# EAGLE design clock (EAGLE 9.6.2)
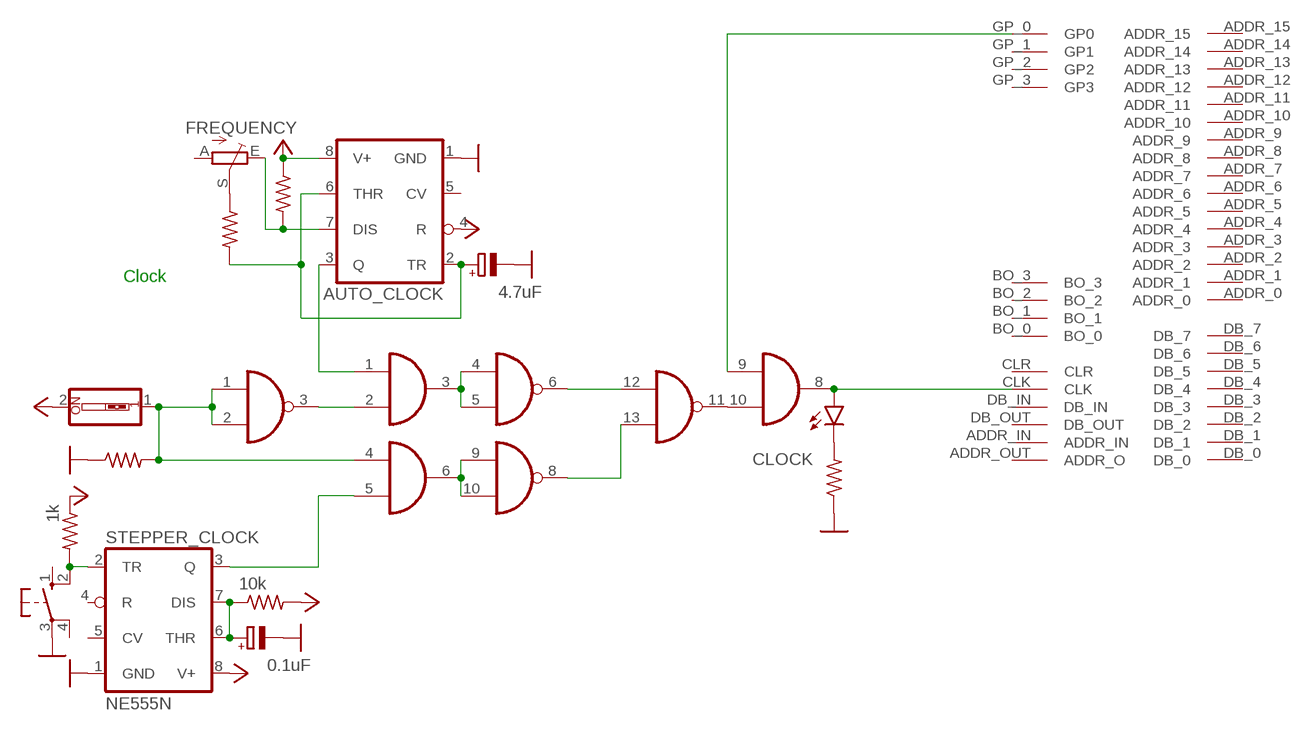
[diagram p0: schematic, sheet 1]

## Parts
AND_GATE_  74LS08N  [DIL14]
AUTO_CLOCK  NE555N  [DIL08]
C1  4.7uF  CPOL-EUE2-5  [E2-5]
C2  0.1uF  CPOL-EUE2-5  [E2-5]
CLK_MODE  SWITCH  SW_DIP-1  [EDG-01]
CLK_TRIGGER  SWITCH  10-XX  [B3F-10XX]
CLOCK  Yellow  LED5MM  [LED5MM]
FREQUENCY  100k  TRIM_EU-RJ9W  [RJ9W]
NAND  74ACT00N  [DIL14]
R1  1k  R-US_0204/7  [0204/7]
R2  1k  R-US_0204/7  [0204/7]
R3  10k  R-US_0204/7  [0204/7]
R4  220  R-US_0204/7  [0204/7]
R5  ~220  R-US_0204/7  [0204/7]
R6  220  R-US_0204/7  [0204/7]
STEPPER_CLOCK  NE555N  [DIL08]
U$1  BACKPLATE_INTERFACEEDGE_FINGER  [BACK_INTERFACE-FOOT]

## Nets
CLOCK: AND_GATE_.8(C:O) CLOCK.A U$1.CLK
GND: AUTO_CLOCK.1(GND) C1.- C2.- CLK_TRIGGER.3(P) R4.1 R5.1 STEPPER_CLOCK.1(GND)
HLT: AND_GATE_.9(C:I0) U$1.GP_0(GP0)
MODE_SIGNAL: AND_GATE_.4(B:I0) CLK_MODE.1 NAND.1(A:I0) NAND.2(A:I1) R4.2
N$1: C2.+ R3.1 STEPPER_CLOCK.6(THR) STEPPER_CLOCK.7(DIS)
N$2: CLK_TRIGGER.2(S1) R2.2 STEPPER_CLOCK.2(TR)
N$3: CLOCK.K(C) R5.2
N$4: AND_GATE_.5(B:I1) STEPPER_CLOCK.3(Q)
N$5: AND_GATE_.3(A:O) NAND.4(B:I0) NAND.5(B:I1)
N$6: AND_GATE_.1(A:I0) AUTO_CLOCK.3(Q)
N$7: AND_GATE_.6(B:O) NAND.9(C:I0) NAND.10(C:I1)
N$8: NAND.8(C:O) NAND.13(D:I1)
N$9: AND_GATE_.2(A:I1) NAND.3(A:O)
N$10: NAND.6(B:O) NAND.12(D:I0)
N$11: AND_GATE_.10(C:I1) NAND.11(D:O)
N$16: AUTO_CLOCK.2(TR) AUTO_CLOCK.6(THR) C1.+ R6.2
N$51: FREQUENCY.S R6.1
N$78: AUTO_CLOCK.7(DIS) FREQUENCY.E R1.2
VCC: AUTO_CLOCK.4(R) AUTO_CLOCK.8(V+) CLK_MODE.2 R1.1 R2.1 R3.2 STEPPER_CLOCK.8(V+)
Unconnected: AND_GATE_.11(D:O) AND_GATE_.12(D:I0) AND_GATE_.13(D:I1) AUTO_CLOCK.5(CV) CLK_TRIGGER.1(S) CLK_TRIGGER.4(P1) FREQUENCY.A STEPPER_CLOCK.4(R) STEPPER_CLOCK.5(CV) U$1.ADDR_0 U$1.ADDR_1 U$1.ADDR_2 U$1.ADDR_3 U$1.ADDR_4 U$1.ADDR_5 U$1.ADDR_6 U$1.ADDR_7 U$1.ADDR_8 U$1.ADDR_9 U$1.ADDR_10 U$1.ADDR_11 U$1.ADDR_12 U$1.ADDR_13 U$1.ADDR_14 U$1.ADDR_15 U$1.ADDR_IN U$1.ADDR_OUT(ADDR_O) U$1.BO_0 U$1.BO_1 U$1.BO_2 U$1.BO_3 U$1.CLR U$1.DB_0 U$1.DB_1 U$1.DB_2 U$1.DB_3 U$1.DB_4 U$1.DB_5 U$1.DB_6 U$1.DB_7 U$1.DB_IN U$1.DB_OUT U$1.GP_1(GP1) U$1.GP_2(GP2) U$1.GP_3(GP3) U$1.NC_0 U$1.NC_1 U$1.NC_2 U$1.NC_3 U$1.NC_4 U$1.NC_5 U$1.NC_6 U$1.NC_7 U$1.NC_8 U$1.NC_9 U$1.NC_10 U$1.NC_11 U$1.NC_12 U$1.NC_13 U$1.NC_14 U$1.NC_15 U$1.NC_16 U$1.NC_17 U$1.NC_18 U$1.NC_19 U$1.NC_20 U$1.NC_21

## Notes on the sheet
- Clock

## Power pins joined to a net without a drawn wire
GND: AND_GATE_.7(P:GND) NAND.7(P:GND) U$1.GND_0(GND) U$1.GND_1(GND)
VCC: AND_GATE_.14(P:VCC) NAND.14(P:VCC) U$1.VCC_0(VCC) U$1.VCC_1(VCC)

## Library data of the parts
AND_GATE_ = 74xx-eu:74*08: Quad 2-input AND gate
AUTO_CLOCK STEPPER_CLOCK = linear:*555: TIMER
C1 C2 = rcl:CPOL-EU: POLARIZED CAPACITOR, European symbol; SPICEPREFIX: C
CLK_MODE = special:SW_DIP-1: DIP SWITCH
CLK_TRIGGER = switch-omron:10-XX: OMRON SWITCH; MPN: B3F-1000; OC_FARNELL: 176432; OC_NEWARK: 36M3542
CLOCK = led:LED: LED OSRAM: - CHIPLED LG R971, LG N971, LY N971, LG Q971, LY Q971, LO R971, LY R971 LH N974, LH R974 LS Q976, LO Q976, LY Q976 LO Q996 - Hyper CHIPLED LW Q18S LB Q993, LB Q99A, LB R99A - SideLED LS A670, LO A670, LY A670, LG A670, LP A670 LB A673, LV A673, LT A673, LW A673 LH A674 LY A675 LS A676, LA A676, LO A676, LY A676, LW A676 LS A679, LY A679, LG A679 - Hyper Micro SIDELED® LS Y876, LA Y876, LO Y876, LY Y876 LT Y87S - SmartLED LW L88C, LW L88S LB L89C, LB L89S, LG L890 LS L89K, LO L89K, LY L89K LS L896, LA L896, LO L896, LY L896 - TOPLED LS T670, LO T670, LY T670, LG T670, LP T670 LSG T670, LSP T670, LSY T670, LOP T670, LYG T670 LG T671, LOG T671, LSG T671 LB T673, LV T673, LT T673, LW T673 LH T674 LS T676, LA T676, LO T676, LY T676, LB T676, LH T676, LSB T676, LW T676 LB T67C, LV T67C, LT T67C, LS T67K, LO T67K, LY T67K, LW E67C LS E67B, LA E67B, LO E67B, LY E67B, LB E67C, LV E67C, LT E67C LW T67C LS T679, LY T679, LG T679 LS T770, LO T770, LY T770, LG T770, LP T770 LB T773, LV T773, LT T773, LW T773 LH T774 LS E675, LA E675, LY E675, LS T675 LS T776, LA T776, LO T776, LY T776, LB T776 LHGB T686 LT T68C, LB T68C - Hyper Mini TOPLED® LB M676 - Mini TOPLED Santana® LG M470 LS M47K, LO M47K, LY M47K Source: http://www.osram.convergy.de LUXEON: - LUMILED® LXK2-PW12-R00, LXK2-PW12-S00, LXK2-PW14-U00, LXK2-PW14-V00 LXK2-PM12-R00, LXK2-PM12-S00, LXK2-PM14-U00 LXK2-PE12-Q00, LXK2-PE12-R00, LXK2-PE12-S00, LXK2-PE14-T00, LXK2-PE14-U00 LXK2-PB12-K00, LXK2-PB12-L00, LXK2-PB12-M00, LXK2-PB14-N00, LXK2-PB14-P00, LXK2-PB14-Q00 LXK2-PR12-L00, LXK2-PR12-M00, LXK2-PR14-Q00, LXK2-PR14-R00 LXK2-PD12-Q00, LXK2-PD12-R00, LXK2-PD12-S00 LXK2-PH12-R00, LXK2-PH12-S00 LXK2-PL12-P00, LXK2-PL12-Q00, LXK2-PL12-R00 Source: www.luxeon.com KINGBRIGHT: KA-3528ASYC Source: www.kingbright.com
FREQUENCY = pot:TRIM_EU-: POTENTIOMETER
NAND = 74xx-eu:74*00: Quad 2-input NAND gate
R1-R6 = rcl:R-US_: RESISTOR, American symbol; SPICEPREFIX: R
U$1 = Computer:BACKPLATE_INTERFACE

## Board
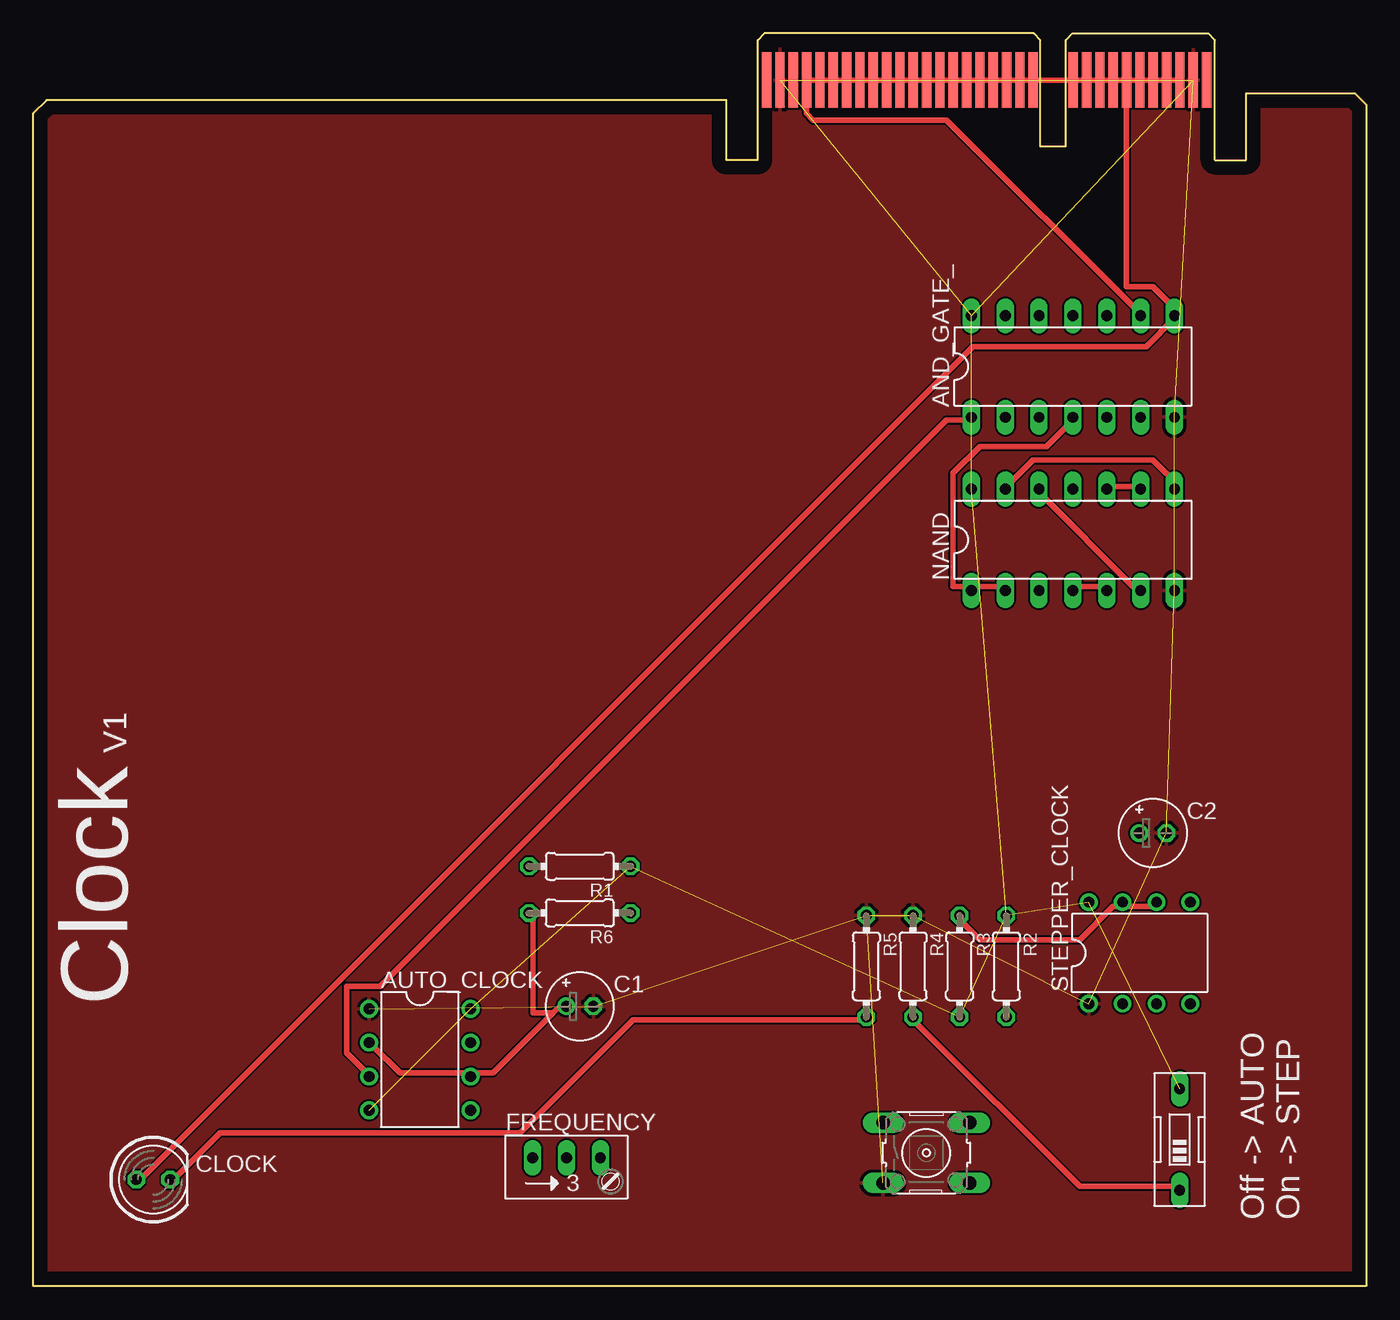
[diagram p1: board, top side]
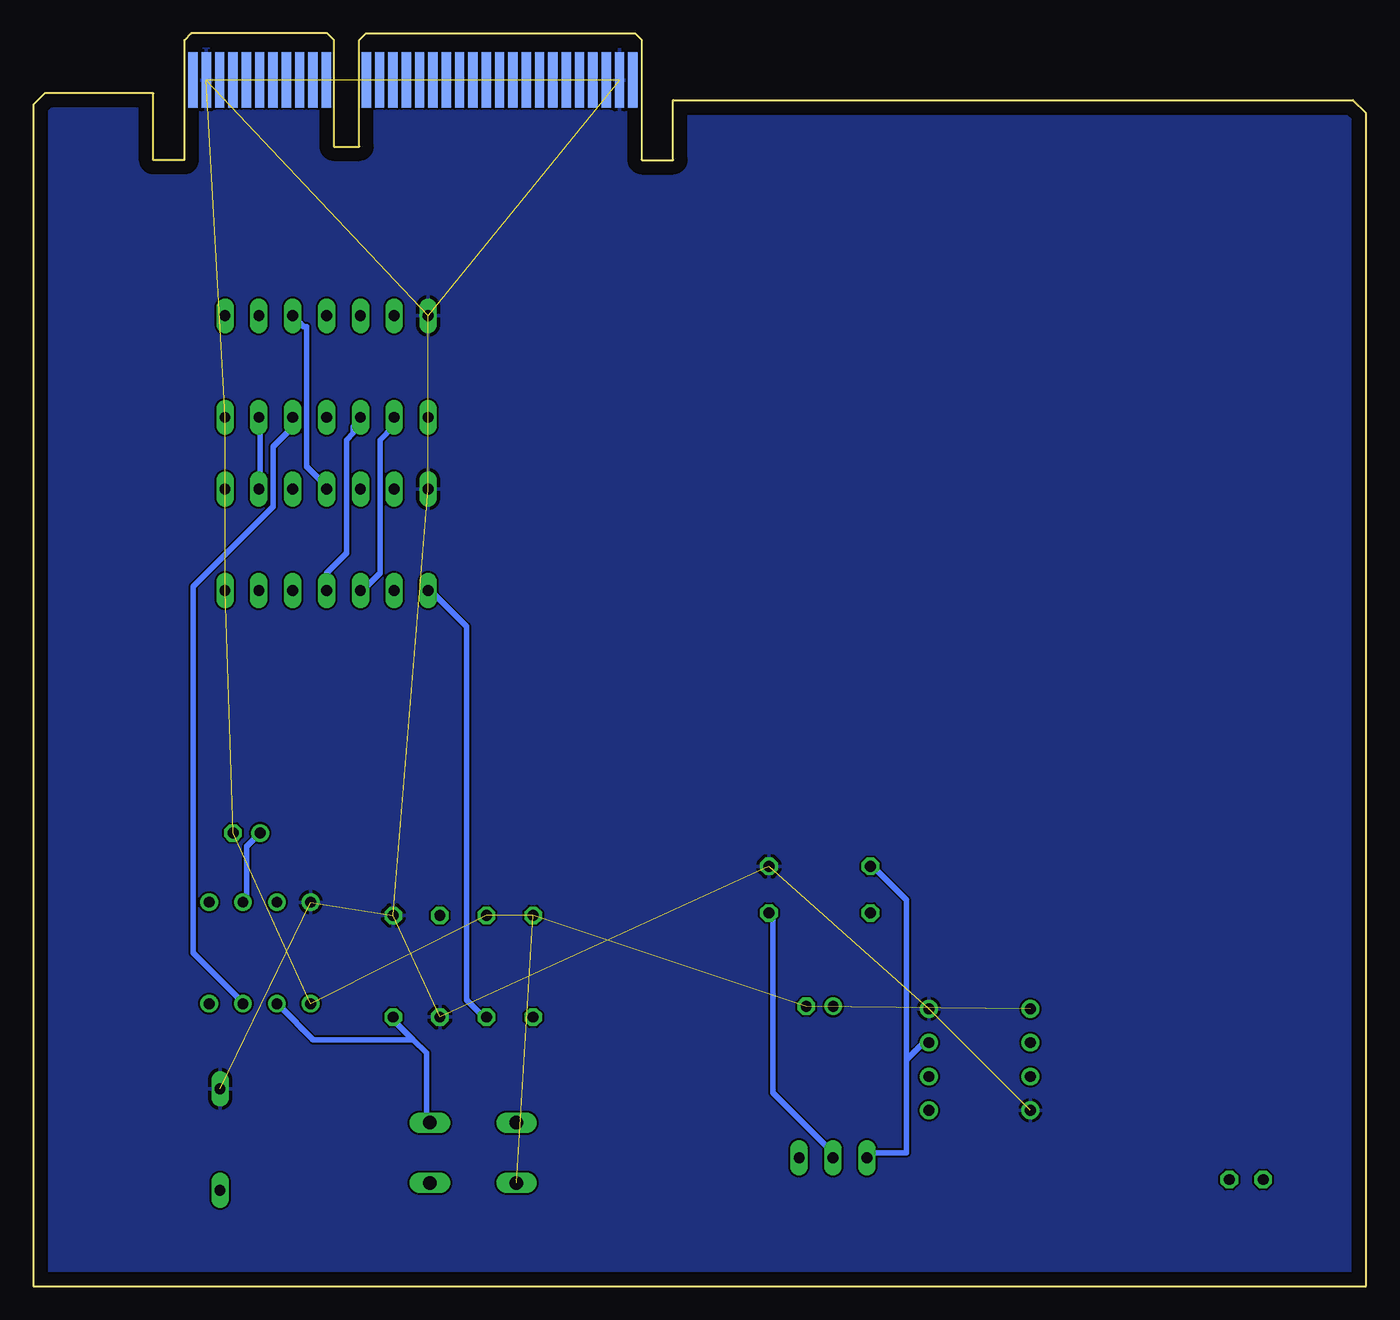
[diagram p2: board, bottom side, seen from below]

Size 100 x 94 mm. Coordinates in mm from the lower left corner, seen from the top.
Outline: 0,0 0,88 1,89 52,89 52,84.5 54.35,84.5 54.35,93.5 54.85,94 75.05,94 75.55,93.5 75.55,85.5 77.45,85.5 77.45,93.5 77.95,94 88.15,94 88.65,93.5 88.65,84.5 91,84.5 91,89.5 99.15,89.5 100,88.65 100,0 0,0
Copper layers (1*16): Top 0.035mm / dielectric 1.5mm / Bottom 0.035mm
Design rules "default *": minimum track width 16mil, minimum drill 0.35mm, track to track 6mil, track to pad 6mil, pad to pad 6mil, via to via 6mil, smd to smd 6mil, copper to edge 40mil, drill to drill 6mil, minimum pad ring 10mil, minimum via ring 8mil, stop-mask expansion 4mil, vias tented up to drill 0mil, thermal gap 10mil

### Footprints (pad centres in the part's own frame; a part is rotated, then mirrored left to right if it is on the bottom)
DIL14 = drill 0.813 long: 1 -7.62,-3.81; 2 -5.08,-3.81; 3 -2.54,-3.81; 4 0,-3.81; 5 2.54,-3.81; 6 5.08,-3.81; 7 7.62,-3.81; 8 7.62,3.81; 9 5.08,3.81; 10 2.54,3.81; 11 0,3.81; 12 -2.54,3.81; 13 -5.08,3.81; 14 -7.62,3.81
DIL08 = drill 0.813 pad 1.27: 1 -3.81,-3.81; 2 -1.27,-3.81; 3 1.27,-3.81; 4 3.81,-3.81; 5 3.81,3.81; 6 1.27,3.81; 7 -1.27,3.81; 8 -3.81,3.81
E2-5 = drill 0.813 pad 1.27: + -1.016,0 | drill 0.813 pad 1.27 octagon: - 1.016,0
EDG-01 = drill 0.813 long: 1 0,-3.81; 2 0,3.81
B3F-10XX = drill 1.016 long: 1 -3.251,2.261; 2 3.251,2.261; 3 -3.251,-2.261; 4 3.251,-2.261
LED5MM = drill 0.813 octagon: A -1.27,0; K 1.27,0
RJ9W = drill 0.813 long: A 2.54,0.635; E -2.54,0.635; S 0,0.635
0204/7 = drill 0.813 octagon: 1 -3.81,0; 2 3.81,0
BACK_INTERFACE-FOOT = smd 0.7 x 4.2: ADDR_0 17.02,0; ADDR_1 16.02,0; ADDR_2 15.02,0; ADDR_3 14.02,0; ADDR_4 13.02,0; ADDR_5 12.02,0; ADDR_6 11.02,0; ADDR_7 10.02,0; ADDR_8 9.02,0; ADDR_9 8.02,0; ADDR_10 7.02,0; ADDR_11 6.02,0; ADDR_12 5.02,0; ADDR_13 4.02,0; ADDR_14 3.02,0; ADDR_15 2.02,0; ADDR_IN 27.02,0; ADDR_OUT 26.02,0; CLK 30.02,0; CLR 31.02,0; DB_IN 29.02,0; DB_OUT 28.02,0; GND_0 32.02,0; GND_1 1.02,0; NC_0 33.02,0; NC_1 25.02,0; NC_2 24.02,0; NC_3 23.02,0; NC_4 20.02,0; NC_5 19.02,0; NC_6 18.02,0; NC_7 0.02,0 | smd 0.7 x 4.2 bottom: BO_0 27.02,0; BO_1 26.02,0; BO_2 25.02,0; BO_3 24.02,0; DB_0 18.02,0; DB_1 17.02,0; DB_2 16.02,0; DB_3 15.02,0; DB_4 14.02,0; DB_5 13.02,0; DB_6 12.02,0; DB_7 11.02,0; GP_0 31.02,0; GP_1 30.02,0; GP_2 29.02,0; GP_3 28.02,0; NC_8 33.02,0; NC_9 23.02,0; NC_10 20.02,0; NC_11 19.02,0; NC_12 10.02,0; NC_13 9.02,0; NC_14 8.02,0; NC_15 7.02,0; NC_16 6.02,0; NC_17 5.02,0; NC_18 4.02,0; NC_19 3.02,0; NC_20 2.02,0; NC_21 0.02,0; VCC_0 32.02,0; VCC_1 1.02,0

### Placement (x,y rotation side)
AND_GATE_  78,69 0 top
AUTO_CLOCK  29,17 270 top
C1  41,21 0 top
C2  84,34 0 top
CLK_MODE  86,11 0 top
CLK_TRIGGER  67,10 0 top
CLOCK  9,8 0 top
FREQUENCY  40,9 0 top
NAND  78,56 0 top
R1  41,31.5 180 top
R2  73,24 270 top
R3  69.5,24 270 top
R4  66,24 270 top
R5  62.5,24 270 top
R6  41,28 180 top
STEPPER_CLOCK  83,25 0 top
U$1  55,90.5 0 top

### Tracks (layer width: path | path; a pad name or v marks a point on that pad's centre or on a via)
CLOCK
  Top 0.406: CLOCK.A 8,8 70.5,70.5 83.5,70.5 85.62,72.62 AND_GATE_.8 85.62,73.38 84,75 82,75 82,90.5 U$1.CLK
GND  (10 unrouted)
  pour Top: 0,88 1,89 52,89 52,84.5 54.35,84.5 54.35,93.5 54.85,94 75.05,94 75.55,93.5 75.55,85.5 77.45,85.5 77.45,93.5 77.95,94 88.15,94 88.65,93.5 88.65,84.5 91,84.5 91,89.5 99.15,89.5 100,88.65 100,0 0,0
HLT  (1 unrouted)
  Top 0.406: U$1.GP_0 58,90.5 58,88 58.5,87.5 68.5,87.5 83.08,72.92 AND_GATE_.9
MODE_SIGNAL
  Top 0.406: NAND.2 72.5,52.5 70.5,52.5 NAND.1 70,52.5 69,52.5 69,61 71,63 76,63 78,65 AND_GATE_.4 | R4.2 66,20 78.5,7.5 86,7.5 CLK_MODE.1
  Bottom 0.406: NAND.1 70,52 67.5,49.5 67.5,21.5 66,20 R4.2
N$1
  Top 0.406: R3.1 69.5,27.5 71,26 78.5,26 81,28.5 81.5,28.5 STEPPER_CLOCK.7 82,28.5 84,28.5 STEPPER_CLOCK.6
  Bottom 0.406: C2.+ 83,34 84,33 84,29 STEPPER_CLOCK.6
N$2
  Bottom 0.406: 71.5,18.5 70.5,17.5 70.5,12.5 CLK_TRIGGER.2 | 71.5,18.5 73,20 R2.2 | 71.5,18.5 79,18.5 81.5,21 STEPPER_CLOCK.2
N$3
  Top 0.406: CLOCK.K 10.5,8 14,11.5 36.5,11.5 45,20 62.5,20 R5.2
N$4
  Bottom 0.406: STEPPER_CLOCK.3 84.5,21.5 88,25 88,52.5 82,58.5 82,63 80.5,64.5 80.5,65 AND_GATE_.5
N$5
  Top 0.406: NAND.4 78,52.5 80.5,52.5 NAND.5
  Bottom 0.406: NAND.4 78,53.5 76.5,55 76.5,63.5 76,64 76,64.5 75.5,65 AND_GATE_.3
N$6
  Top 0.406: AUTO_CLOCK.3 25,16 23.5,17.5 23.5,22.5 26,22.5 68.5,65 70,65 AND_GATE_.1
N$7
  Top 0.406: NAND.10 81,60 83,60 NAND.9
  Bottom 0.406: AND_GATE_.6 83,65 83,60 NAND.9
N$8
  Top 0.406: NAND.13 73,60 75,62 84,62 86,60 NAND.8
N$9
  Bottom 0.406: NAND.3 75,52.5 74,53.5 74,63.5 73,64.5 73,65 AND_GATE_.2
N$10
  Top 0.406: NAND.12 75.5,59.5 82.5,52.5 83,52.5 NAND.6
N$11
  Bottom 0.406: NAND.11 78,60 79.5,61.5 79.5,72 79.73,72 AND_GATE_.10
N$16
  Top 0.406: AUTO_CLOCK.2 25.5,18 27.5,16 32.5,16 AUTO_CLOCK.6 33,16 34.5,16 39,20.5 | 39,20.5 39.5,21 C1.+ | 39,20.5 37.5,20.5 37.5,28 R6.2
N$51
  Bottom 0.406: FREQUENCY.S 40,10 44.5,14.5 44.5,28 R6.1
N$78
  Bottom 0.406: 34.5,17 34.5,10 37,10 FREQUENCY.E | 34.5,17 33,18.5 AUTO_CLOCK.7 | 34.5,17 34.5,29 37,31.5 R1.2
VCC  (10 unrouted)
  pour Bottom: 0,88 1,89 52,89 52,84.5 54.35,84.5 54.35,93.5 54.85,94 75.05,94 75.55,93.5 75.55,85.5 77.45,85.5 77.45,93.5 77.95,94 88.15,94 88.65,93.5 88.65,84.5 91,84.5 91,89.5 99.15,89.5 100,88.65 100,0 0,0

### Text on the board
tNames: V1 | Clock | Off -> AUTO / On -> STEP